# EAGLE design FingersFlexpcb (EAGLE 9.5.0)
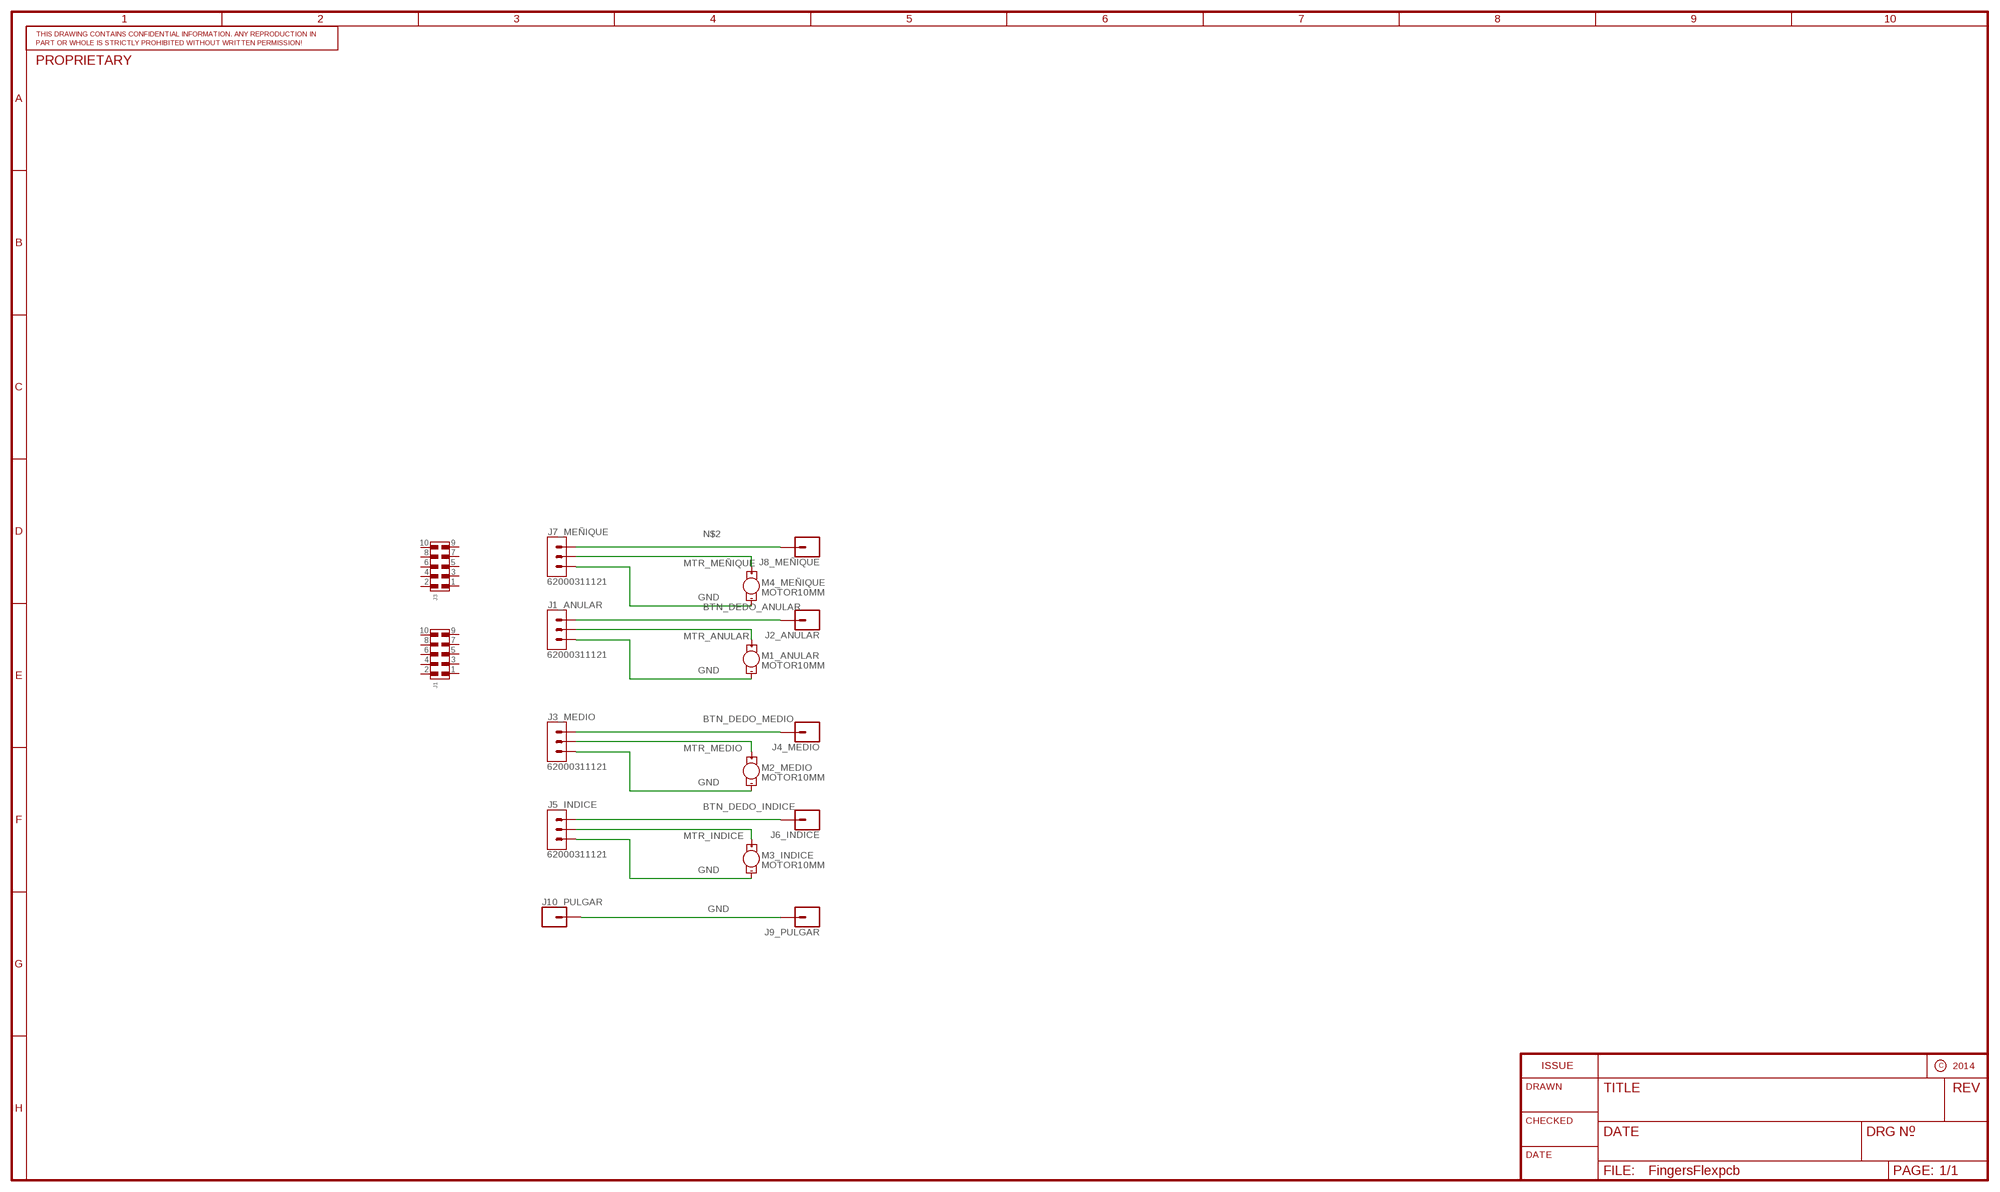
[diagram p0: schematic, sheet 1]

## Parts
J1  6100XX21121_61001021121  [61001021121]
J1_ANULAR  62000311121  [62000311121]
J2_ANULAR  CONN_01  [1X01]
J3  6100XX21121_61001021121  [61001021121]
J3_MEDIO  62000311121  [62000311121]
J4_MEDIO  CONN_01  [1X01]
J5_INDICE  62000311121  [62000311121]
J6_INDICE  CONN_01  [1X01]
J7_MEÑIQUE  62000311121  [62000311121]
J8_MEÑIQUE  CONN_01  [1X01]
J9_PULGAR  CONN_01  [1X01]
J10_PULGAR  CONN_01  [1X01]
M1_ANULAR  MOTOR10MM  [VIBE-MOTOR-10MM]
M2_MEDIO  MOTOR10MM  [VIBE-MOTOR-10MM]
M3_INDICE  MOTOR10MM  [VIBE-MOTOR-10MM]
M4_MEÑIQUE  MOTOR10MM  [VIBE-MOTOR-10MM]

## Nets
BTN_DEDO_ANULAR: J1_ANULAR.1 J2_ANULAR.1
BTN_DEDO_INDICE: J5_INDICE.1 J6_INDICE.1
BTN_DEDO_MEDIO: J3_MEDIO.1 J4_MEDIO.1
GND: J1_ANULAR.3 J3_MEDIO.3 J5_INDICE.3 J7_MEÑIQUE.3 J9_PULGAR.1 J10_PULGAR.1 M1_ANULAR.- M2_MEDIO.- M3_INDICE.- M4_MEÑIQUE.-
MTR_ANULAR: J1_ANULAR.2 M1_ANULAR.+
MTR_INDICE: J5_INDICE.2 M3_INDICE.+
MTR_MEDIO: J3_MEDIO.2 M2_MEDIO.+
MTR_MEÑIQUE: J7_MEÑIQUE.2 M4_MEÑIQUE.+
N$2: J7_MEÑIQUE.1 J8_MEÑIQUE.1
Unconnected: J1.1 J1.2 J1.3 J1.4 J1.5 J1.6 J1.7 J1.8 J1.9 J1.10 J3.1 J3.2 J3.3 J3.4 J3.5 J3.6 J3.7 J3.8 J3.9 J3.10

## Library data of the parts
J1 J3 = Wurth_Connectors_WR-PHD:6100XX21121_61001021121: WR-PHD 2.54 mm SMT Dual Pin Header ARTICLE PROPERTIES: Pins:4;​ 6;​ 8;​ 10;​ 12;​ 14;​ 16;​ 20;​ 22;​ 24;​ 26;​ 32;​ 34;​ 36 KIND PROPERTIES: Pitch：2.54 mm Quality Class:3 as per CECC 75 301-802 Rows：Dual Gender：Pin Header Type：Straight MATERIAL PROPERTIES: Insulator Material :PA6T Insulator Flammability Rating:UL94 V-0 Contact Material:Copper Alloy Contact Plating:Gold Contact Type:Stamped GENERAL INFORMATION Operating Temperature:-40 up to +125 °C Compliance:Lead free / RoHS ELECTRICAL PROPERTIES: Rated Current:3 A IR 1:3 A Withstanding Voltage:500 V (AC) Contact Resistance:20 mΩ RISO:1000 MΩ CERTIFICATION UL Approval:E323964 PACKAGING PROPERTIES Packaging:Tube <https://katalog.we-online.com/media/images/v2/o33205v209%20Family_WR-PHD_610xxx21121.jpg> Details see: https://katalog.we-online.com/en/em/PHD_2_54_SMT_DUAL_PIN_HEADER_6100XX21121 Updated by Yingchun,Shan 2019-10-18 2019 (C) Würth Elektronik; DATASHEET-URL: https://katalog.we-online.com/em/datasheet/61001021121.pdf; GENDER: Pin Header; IR: 3A; MATES: WR-PHD 2.54mm Angled DualSocket Header/Dual Socket Header/Dual Socket Header Bottom Entry/Dual Socket Header Bottom Entry Large/SMT Dual Socket Header/SMT Dual Socket Header Bottom Entry; PACKAGING: Tube; PART-NUMBER: 61001021121; PINS: 10; ROWS: Dual; TYPE: Straight
J1_ANULAR J3_MEDIO J5_INDICE J7_MEÑIQUE = Headers:62000311121: THT Vertical Pin Header WR-PHD, Pitch 2.00 mm, Single Row, 3 pins Manufacturer's datasheet <https://datasheet.octopart.com/62000311121-W%C3%BCrth-Elektronik-datasheet-117282002.pdf>; CREATED_BY: PCBLayout.com; MANUFACTURER: Würth Elektronik; MPN: 62000311121
J2_ANULAR J4_MEDIO J6_INDICE J8_MEÑIQUE J9_PULGAR J10_PULGAR = SparkFun-Connectors:CONN_01: Single connection point. Often used as Generic Header-pin footprint for 0.1 inch spaced/style header connections On any of the 0.1 inch spaced packages, you can populate with these: Break Away Headers - Straight <https://www.sparkfun.com/products/116> (PRT-00116) Break Away Male Headers - Right Angle <https://www.sparkfun.com/products/553> (PRT-00553) Female Headers <https://www.sparkfun.com/products/115> (PRT-00115) Break Away Headers - Machine Pin <https://www.sparkfun.com/products/117> (PRT-00117) Break Away Female Headers - Swiss Machine Pin <https://www.sparkfun.com/products/743> (PRT-00743) This device is also useful as a general connection point to wire up your design to another part of your project. Our various solder wires solder well into these plated through hole pads. Hook-Up Wire - Assortment (Stranded, 22 AWG) <https://www.sparkfun.com/products/11375> (PRT-11375) Hook-Up Wire - Assortment (Solid Core, 22 AWG) <https://www.sparkfun.com/products/11367> (PRT-11367) View the entire wire category on our website here <https://www.sparkfun.com/categories/141> Special notes: SMTSO-256-ET is a "flush mount" nut for a 4-40 screw. We mostly use this on specialty testbeds; it is a nice way to connect hardware to your PCB at an adjustable hieght. Also note, the SNAP packages are for using a snappable style connector. We sell a baggie of snaps and they are also used on two LilyPad designs: Snap Assortment - 30 pack (male and female) <https://www.sparkfun.com/products/11347> (DEV-11347) LilyPad Arduino SimpleSnap <https://www.sparkfun.com/products/10941> (DEV-10941) LilyPad SimpleSnap Protoboard <https://www.sparkfun.com/products/10940> (DEV-10940)
M1_ANULAR M2_MEDIO M3_INDICE M4_MEÑIQUE = SparkFun-Electromechanical:MOTOR: Motor (Single-Phase) Two-terminal, single-phase motors. SparkFun Products Vibration Motor <https://www.sparkfun.com/products/8449> (ROB-08449) Physical dimension and wire connections for this powerful vibration motor. Motor has a self adhesive backing.; PROD_ID: COMP-08572; SF_SKU: ROB-08449

## Board
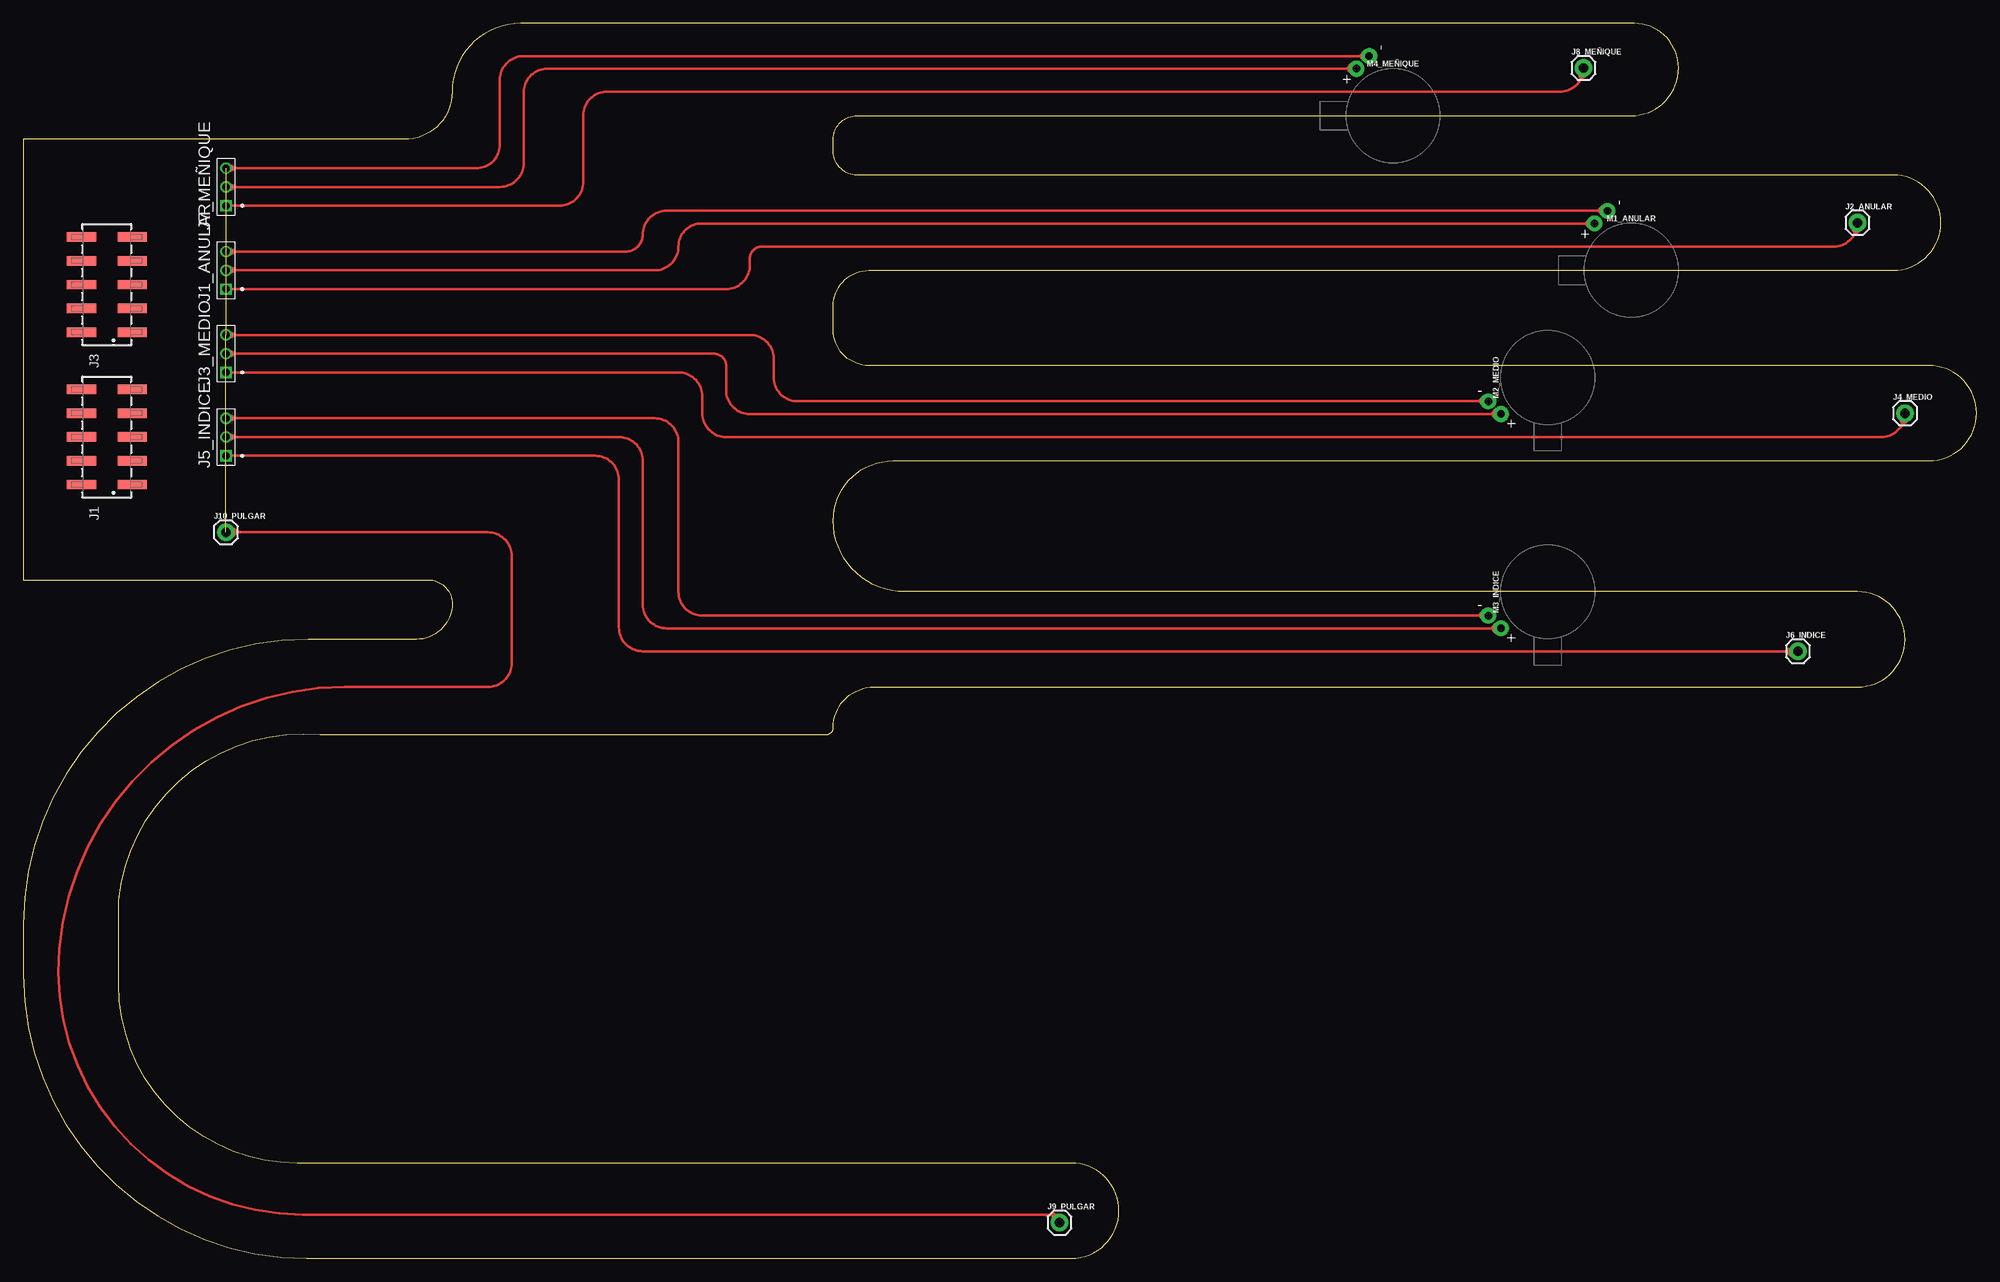
[diagram p1: board, top side]

Size 208.28 x 131.75 mm. Coordinates in mm from the lower left corner, seen from the top.
Outline: 0,72.39 43.18,72.39 arc-90 45.72,69.85 arc-90 41.91,66.04 30.35,66.04 arc90 0,35.69 0,30.22 arc90 30.22,0 111.74,0 arc90 116.83,5.08 arc90 111.76,10.16 29.21,10.16 arc-90 10.16,29.21 10.16,38.19 arc-90 31.66,55.88 85.62,55.88 arc90 86.36,56.62 arc-90 90.7,60.96 195.58,60.96 arc90 200.66,66.04 arc90 195.58,71.12 93.98,71.12 arc-90 86.36,78.74 arc-90 92.71,85.09 203.2,85.09 arc90 208.28,90.17 arc90 203.2,95.25 90.17,95.25 arc-90 86.36,99.06 86.36,101.6 arc-90 90.17,105.41 199.39,105.41 arc90 204.47,110.49 arc90 199.39,115.57 88.9,115.57 arc-90 86.36,118.11 86.36,119.38 arc-90 88.9,121.92 171.41,121.9 arc90 176.51,127 arc90 171.76,131.75 53.01,131.75 arc90 45.72,124.46 arc-90 40.64,119.38 0,119.38 0,72.39
Copper layers (1*16): Top 0.035559375mm / dielectric 1.6mm / Bottom 0.035559375mm
Design rules "oshpark-2layer": minimum track width 6mil, minimum drill 10mil, track to track 6mil, track to pad 6mil, pad to pad 6mil, via to via 6mil, smd to smd 6mil, copper to edge 15mil, drill to drill 6mil, minimum pad ring 5mil, minimum via ring 5mil, stop-mask expansion 2.5mil, vias tented up to drill 0mil, thermal gap 10mil

### Footprints (pad centres in the part's own frame; a part is rotated, then mirrored left to right if it is on the bottom)
61001021121 = smd 1 x 3.1: 1 -5.08,-2.7; 2 -5.08,2.7; 3 -2.54,-2.7; 4 -2.54,2.7; 5 0,-2.7; 6 0,2.7; 7 2.54,-2.7; 8 2.54,2.7; 9 5.08,-2.7; 10 5.08,2.7
62000311121 = drill 0.8 square: 1 -2,0 | drill 0.8: 2 0,0; 3 2,0
1X01 = drill 1.016 pad 1.88: 1 0,0
VIBE-MOTOR-10MM = drill 0.8 pad 1.676: + -5,-3.9; - -6.35,-2.54

### Placement (x,y rotation side)
J1  8.89,87.63 90 top
J1_ANULAR  21.59,105.41 90 top
J2_ANULAR  195.58,110.49 0 top
J3  8.89,103.89 90 top
J3_MEDIO  21.59,96.52 90 top
J4_MEDIO  200.66,90.17 0 top
J5_INDICE  21.59,87.63 90 top
J6_INDICE  189.23,64.77 0 top
J7_MEÑIQUE  21.59,114.3 90 top
J8_MEÑIQUE  166.37,127 0 top
J9_PULGAR  110.49,3.81 0 top
J10_PULGAR  21.59,77.47 0 top
M1_ANULAR  171.45,105.41 270 top
M2_MEDIO  162.56,93.98 0 top
M3_INDICE  162.56,71.12 0 top
M4_MEÑIQUE  146.05,121.92 270 top

### Tracks (layer width: path | path; a pad name or v marks a point on that pad's centre or on a via)
BTN_DEDO_ANULAR
  Top 0.254: J1_ANULAR.1 74.93,103.41 arc90 77.47,105.95 77.47,106.68 arc-90 78.74,107.95 193.04,107.95 arc90 J2_ANULAR.1
  Top 0.508: 195.38,109.5 195.98,109.94 J2_ANULAR.1 194.99,110.14 195.38,109.5
BTN_DEDO_INDICE
  Top 0.254: J5_INDICE.1 60.96,85.63 arc-90 63.5,83.09 63.5,67.31 arc90 66.04,64.77 188.21,64.77 J6_INDICE.1
  Top 0.508: 188.21,64.77 188.77,64.26 J6_INDICE.1 188.77,65.28 188.21,64.77
BTN_DEDO_MEDIO
  Top 0.254: J3_MEDIO.1 69.85,94.52 arc-90 72.39,91.98 72.39,90.17 arc90 74.93,87.63 198.12,87.63 arc90 J4_MEDIO.1
  Top 0.508: 200.46,89.17 201.06,89.61 J4_MEDIO.1 200.07,89.82 200.46,89.17
GND  (4 unrouted)
  Top 0.254: J7_MEÑIQUE.3 22.39,116.3 48.26,116.3 arc90 50.8,118.84 50.8,125.73 arc-90 53.34,128.27 142.71,128.27 M4_MEÑIQUE.- | J1_ANULAR.3 22.39,107.41 64.23,107.41 arc90 66.04,109.22 arc-90 68.58,111.76 168.11,111.76 M1_ANULAR.- | J3_MEDIO.3 22.39,98.52 77.47,98.52 arc-90 80.01,95.98 80.01,93.98 arc90 82.55,91.44 155.41,91.44 M2_MEDIO.- | J5_INDICE.3 22.39,89.63 67.31,89.63 arc-90 69.85,87.09 69.85,71.12 arc90 72.39,68.58 155.41,68.58 M3_INDICE.- | J10_PULGAR.1 22.61,77.47 49.53,77.47 arc-90 52.07,74.93 52.07,63.5 arc-90 49.53,60.96 34.29,60.96 arc85 3.81,33.02 arc95 29.8,4.67 109.63,4.67 arc-90 J9_PULGAR.1
  Top 0.508: 22.39,107.41 21.74,107.72 J1_ANULAR.3 21.74,107.1 22.39,107.41 | 168.11,111.76 168.48,111.36 M1_ANULAR.- 168.48,112.16 168.11,111.76 | 22.39,98.52 21.74,98.83 J3_MEDIO.3 21.74,98.21 22.39,98.52 | 155.41,91.44 155.78,91.04 M2_MEDIO.- 155.78,91.84 155.41,91.44 | 22.39,89.63 21.74,89.94 J5_INDICE.3 21.74,89.32 22.39,89.63 | 155.41,68.58 155.78,68.18 M3_INDICE.- 155.78,68.98 155.41,68.58 | 22.39,116.3 21.74,116.61 J7_MEÑIQUE.3 21.74,115.99 22.39,116.3 | 142.71,128.27 143.08,127.87 M4_MEÑIQUE.- 143.08,128.67 142.71,128.27 | 22.61,77.47 22.05,77.98 J10_PULGAR.1 22.05,76.96 22.61,77.47 | 109.89,4.63 109.81,3.88 J9_PULGAR.1 110.62,4.48 109.89,4.63
MTR_ANULAR
  Top 0.254: J1_ANULAR.2 22.39,105.41 67.31,105.41 arc90 69.85,107.95 arc-90 72.31,110.41 166.75,110.41 M1_ANULAR.+
  Top 0.508: 166.75,110.41 167.12,110.01 M1_ANULAR.+ 167.12,110.81 166.75,110.41 | 22.39,105.41 21.74,105.72 J1_ANULAR.2 21.74,105.1 22.39,105.41
MTR_INDICE
  Top 0.254: J5_INDICE.2 22.39,87.63 63.5,87.63 arc-90 66.04,85.09 66.04,69.76 arc90 68.58,67.22 156.76,67.22 M3_INDICE.+
  Top 0.508: 156.76,67.22 157.13,66.82 M3_INDICE.+ 157.13,67.62 156.76,67.22 | 22.39,87.63 21.74,87.94 J5_INDICE.2 21.74,87.32 22.39,87.63
MTR_MEDIO
  Top 0.254: J3_MEDIO.2 22.39,96.52 73.66,96.52 arc-90 74.93,95.25 74.93,92.62 arc90 77.47,90.08 156.76,90.08 M2_MEDIO.+
  Top 0.508: 156.76,90.08 157.13,89.68 M2_MEDIO.+ 157.13,90.48 156.76,90.08 | 22.39,96.52 21.74,96.83 J3_MEDIO.2 21.74,96.21 22.39,96.52
MTR_MEÑIQUE
  Top 0.254: J7_MEÑIQUE.2 22.39,114.3 50.8,114.3 arc90 53.34,116.84 53.34,124.38 arc-90 55.88,126.92 141.35,126.92 M4_MEÑIQUE.+
  Top 0.508: 141.35,126.92 141.72,126.52 M4_MEÑIQUE.+ 141.72,127.32 141.35,126.92 | 22.39,114.3 21.74,114.61 J7_MEÑIQUE.2 21.74,113.99 22.39,114.3
N$2
  Top 0.254: J7_MEÑIQUE.1 57.15,112.3 arc90 59.69,114.84 59.69,121.92 arc-90 62.23,124.46 163.83,124.46 arc90 J8_MEÑIQUE.1
  Top 0.508: 166.17,126 166.77,126.44 J8_MEÑIQUE.1 165.78,126.65 166.17,126